# EAGLE board lisa_l (EAGLE 6.1), part 1 of 2
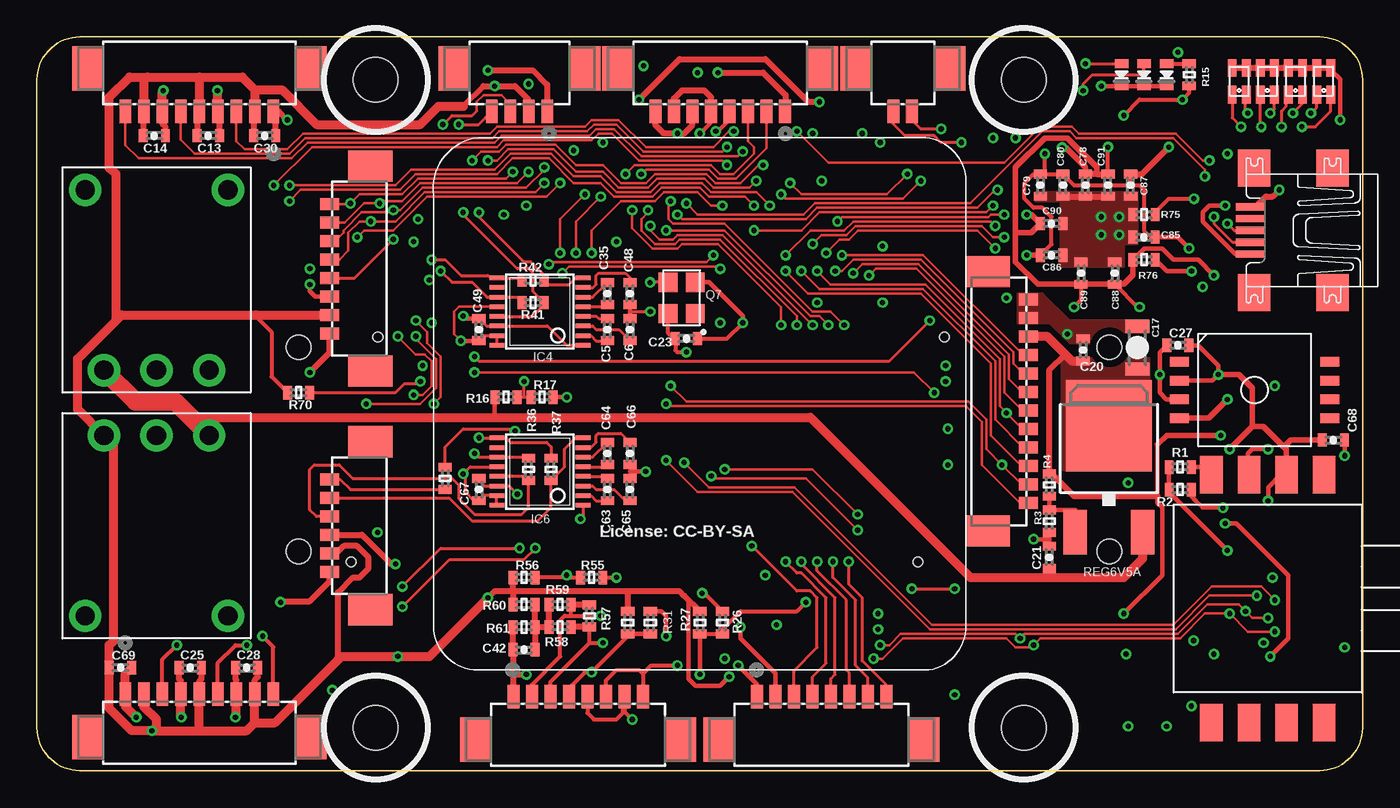
[diagram p6: board, top side]
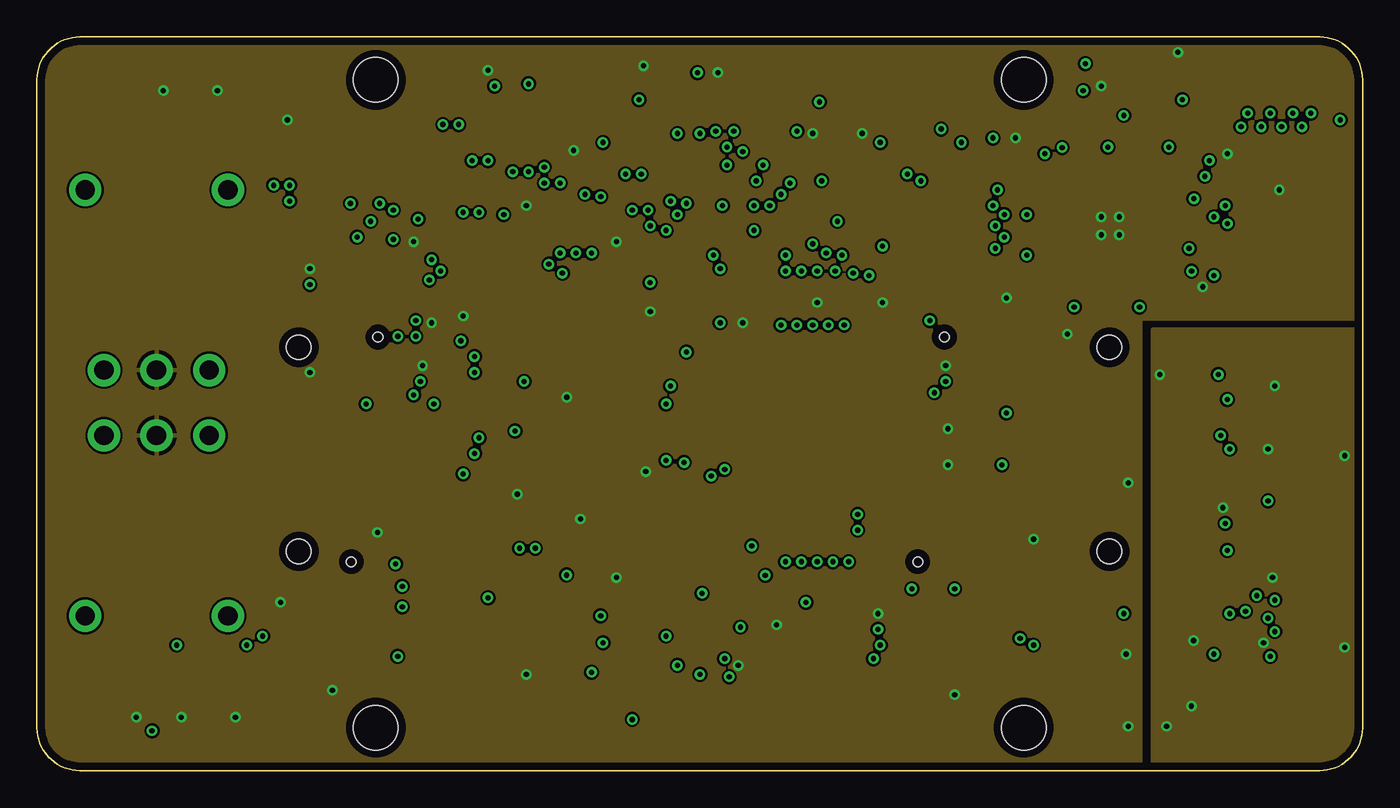
[diagram p7: board, inner layer Route2]
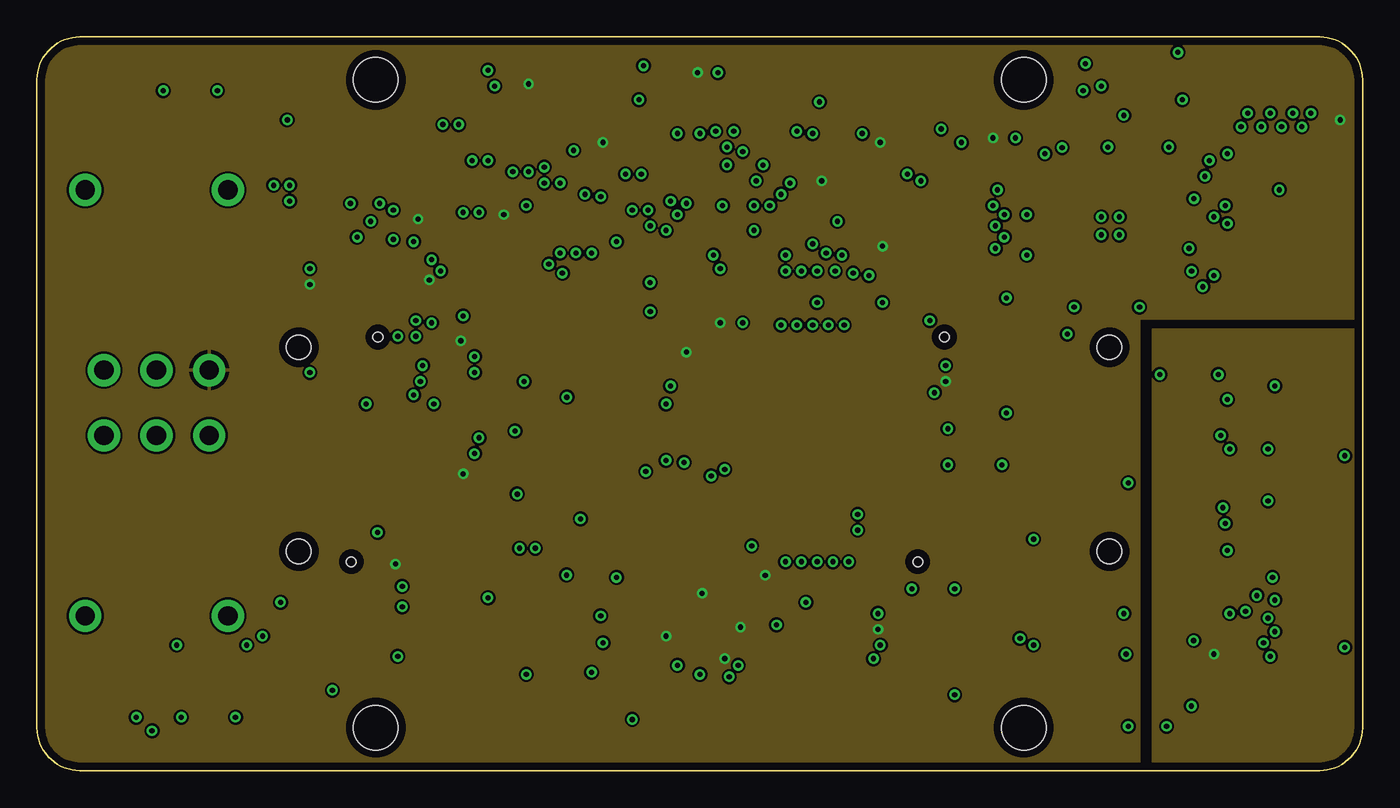
[diagram p8: board, inner layer Route15]
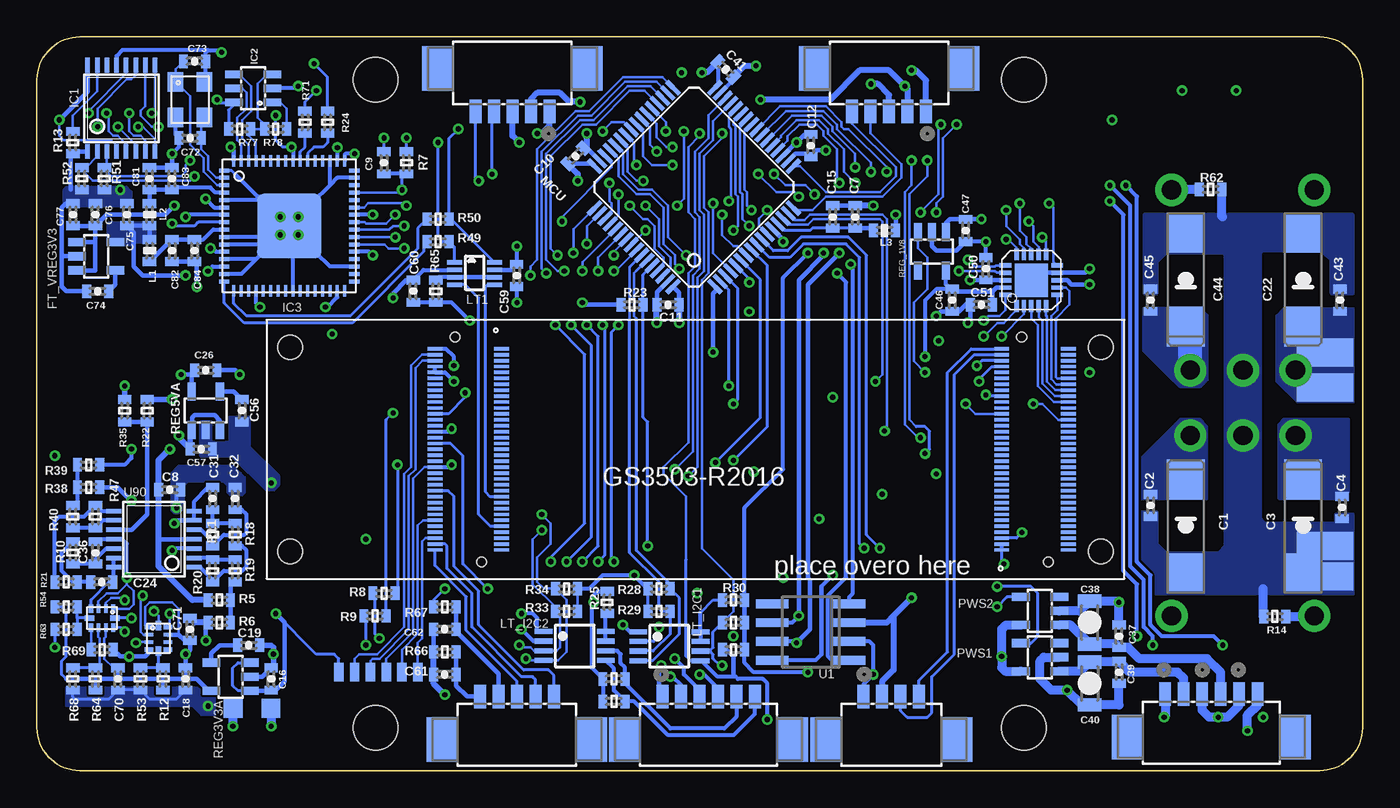
[diagram p9: board, bottom side, seen from below]

Size 89.6 x 49.6 mm. Coordinates in mm from the lower left corner, seen from the top.
Outline: 2.9,49.6 86.7,49.6 arc-90 89.6,46.7 89.6,2.9 arc-90 86.7,0 2.9,0 arc-90 0,2.9 0,46.7 arc-90 2.9,49.6
Copper layers (1*2+15*16): Top 0.035mm / dielectric 0.2mm / Route2 0.035mm / dielectric 1.5mm / Route15 0.035mm / dielectric 0.2mm / Bottom 0.035mm
Design rules: minimum track width 0.15mm, minimum drill 0.35mm, track to track 0.15mm, track to pad 0.15mm, pad to pad 0.15mm, via to via 0.15mm, smd to smd 0.15mm, copper to edge 20mil, drill to drill 8mil, minimum pad ring 0.177mm, minimum via ring 0.177mm, stop-mask expansion 4mil, vias tented up to drill 14mil, thermal gap 10mil
Net classes: 0 default: width 0.152 mm, drill 0.305 mm, clearance 0.152 mm; 1 supply: width 0.203 mm; 4 xxwide: width 0.203 mm; 5 USB: width 0.191 mm
Holes 3 mm at 66.7,46.7 66.7,2.9 22.9,46.7 22.9,2.9
bKeepout: area 19.9,43.7 to 25.9,49.7; area 63.7,43.7 to 69.7,49.7; area 19.9,-0.1 to 25.9,5.9; area 63.7,-0.1 to 69.7,5.9
tRestrict: area 63.6,43.6 to 69.8,49.8; area 63.6,-0.2 to 69.8,6; area 19.8,-0.2 to 26,6; area 19.8,43.6 to 26,49.8

## Footprints (pad centres in the part's own frame; a part is rotated, then mirrored left to right if it is on the bottom)
R-PQFP-N10 = smd 0.3 x 0.58: P$1 0.75,0.637; P$4 -0.75,0.637; P$6 -0.75,-0.637; P$9 0.75,-0.637 | smd 0.25 x 0.58: P$2 0.25,0.637; P$3 -0.25,0.637; P$7 -0.25,-0.637; P$8 0.25,-0.637 | smd 0.63 x 0.35: P$5 -0.863,0; P$10 0.863,0
CASE_1317 = smd 1.27 x 0.635: P$1 5.08,-1.905; P$2 5.08,-0.635; P$3 5.08,0.635; P$4 5.08,1.905; P$5 -5.08,1.905; P$6 -5.08,0.635; P$7 -5.08,-0.635; P$8 -5.08,-1.905
CASE1351 = smd 2.54 x 1.524: P$1 8.382,-3.81; P$2 8.382,-1.27; P$3 8.382,1.27; P$4 8.382,3.81; P$5 -8.382,3.81; P$6 -8.382,1.27; P$7 -8.382,-1.27; P$8 -8.382,-3.81
SOLD_PAD_150_75 = smd 3.81 x 1.905: P$1 0,0
7343/D = smd 2.7 x 2.55: + -3.175,0; - 3.175,0
0603-CAP = smd 0.6 x 0.9: P$1 -0.75,0; P$2 0.75,0
1206-CAP = smd 0.9 x 1.6: P$1 -1.45,0; P$2 1.45,0
PB-53261-06 = smd 0.8 x 1.6: 1 -3.125,1.1; 2 -1.875,1.1; 3 -0.625,1.1; 4 0.625,1.1; 5 1.875,1.1; 6 3.125,1.1 | smd 2.1 x 3: MNT1 -5.675,-1.8; MNT2 5.675,-1.8
PB-53398-12 = smd 0.8 x 1.3: 1 -6.875,1.25; 2 -5.625,1.25; 3 -4.375,1.25; 4 -3.125,1.25; 5 -1.875,1.25; 6 -0.625,1.25; 7 0.625,1.25; 8 1.875,1.25; 9 3.125,1.25; 10 4.375,1.25; 11 5.625,1.25; 12 6.875,1.25 | smd 2.1 x 3: PAD1 -8.775,-1.5; PAD2 8.775,-1.5
PB-53261-08 = smd 0.8 x 1.6: 1 -4.375,1.1; 2 -3.125,1.1; 3 -1.875,1.1; 4 -0.625,1.1; 5 0.625,1.1; 6 1.875,1.1; 7 3.125,1.1; 8 4.375,1.1 | smd 2.1 x 3: MNT1 -6.925,-1.8; MNT2 6.925,-1.8
PB-53398-08 = smd 0.8 x 1.3: 1 -4.375,1.25; 2 -3.125,1.25; 3 -1.875,1.25; 4 -0.625,1.25; 5 0.625,1.25; 6 1.875,1.25; 7 3.125,1.25; 8 4.375,1.25 | smd 2.1 x 3: PAD1 -6.925,-1.5; PAD2 6.925,-1.5
PB-53261-04 = smd 0.8 x 1.6: 1 -1.875,1.1; 2 -0.625,1.1; 3 0.625,1.1; 4 1.875,1.1 | smd 2.1 x 3: MNT1 -4.425,-1.8; MNT2 4.425,-1.8
PB-53261-02 = smd 0.8 x 1.6: 1 -0.625,1.1; 2 0.625,1.1 | smd 2.1 x 3: MNT1 -3.175,-1.8; MNT2 3.175,-1.8
PB-53261-05 = smd 0.8 x 1.6: 1 -2.5,1.1; 2 -1.25,1.1; 3 0,1.1; 4 1.25,1.1; 5 2.5,1.1 | smd 2.1 x 3: MNT1 -5.05,-1.8; MNT2 5.05,-1.8
PB-53261-09 = smd 0.8 x 1.6: 1 -5,1.1; 2 -3.75,1.1; 3 -2.5,1.1; 4 -1.25,1.1; 5 0,1.1; 6 1.25,1.1; 7 2.5,1.1; 8 3.75,1.1; 9 5,1.1 | smd 2.1 x 3: MNT1 -7.55,-1.8; MNT2 7.55,-1.8
PB-53398-06 = smd 0.8 x 1.3: 1 -3.125,1.25; 2 -1.875,1.25; 3 -0.625,1.25; 4 0.625,1.25; 5 1.875,1.25; 6 3.125,1.25 | smd 2.1 x 3: PAD1 -5.675,-1.5; PAD2 5.675,-1.5
UX60A-MB-5ST = smd 2 x 0.5: 1 2.25,1.6; 2 2.25,0.8; 3 2.25,0; 4 2.25,-0.8; 5 2.25,-1.6 | smd 2.2 x 2.5: M1 -3.3,-4.2; M2 -3.3,4.2; M3 2,4.2; M4 2,-4.2
SOT23-5 = smd 0.55 x 1.2: 1 -0.95,-1.3; 2 0,-1.3; 3 0.95,-1.3; 4 0.95,1.3; 5 -0.95,1.3
TSSOP16 = smd 0.305 x 0.991: 1 -2.275,-2.918; 2 -1.625,-2.918; 3 -0.975,-2.918; 4 -0.325,-2.918; 5 0.325,-2.918; 6 0.975,-2.918; 7 1.625,-2.918; 8 2.275,-2.918; 9 2.275,2.918; 10 1.625,2.918; 11 0.975,2.918; 12 0.325,2.918; 13 -0.325,2.918; 14 -0.975,2.918; 15 -1.625,2.918; 16 -2.275,2.918
SO23-6 = smd 0.5 x 1.2: 1 -0.95,-1.3; 2 0,-1.3; 3 0.95,-1.3; 4 0.95,1.3; 5 0,1.3; 6 -0.95,1.3
QFN64 = smd 0.75 x 0.25: P$1 -4.4,3.75; P$2 -4.4,3.25; P$3 -4.4,2.75; P$4 -4.4,2.25; P$5 -4.4,1.75; P$6 -4.4,1.25; P$7 -4.4,0.75; P$8 -4.4,0.25; P$9 -4.4,-0.25; P$10 -4.4,-0.75; P$11 -4.4,-1.25; P$12 -4.4,-1.75; P$13 -4.4,-2.25; P$14 -4.4,-2.75; P$15 -4.4,-3.25; P$16 -4.4,-3.75; P$33 4.4,-3.75; P$34 4.4,-3.25; P$35 4.4,-2.75; P$36 4.4,-2.25; P$37 4.4,-1.75; P$38 4.4,-1.25; P$39 4.4,-0.75; P$40 4.4,-0.25; P$41 4.4,0.25; P$42 4.4,0.75; P$43 4.4,1.25; P$44 4.4,1.75; P$45 4.4,2.25; P$46 4.4,2.75; P$47 4.4,3.25; P$48 4.4,3.75 | smd 0.25 x 0.75: P$17 -3.75,-4.4; P$18 -3.25,-4.4; P$19 -2.75,-4.4; P$20 -2.25,-4.4; P$21 -1.75,-4.4; P$22 -1.25,-4.4; P$23 -0.75,-4.4; P$24 -0.25,-4.4; P$25 0.25,-4.4; P$26 0.75,-4.4; P$27 1.25,-4.4; P$28 1.75,-4.4; P$29 2.25,-4.4; P$30 2.75,-4.4; P$31 3.25,-4.4; P$32 3.75,-4.4; P$49 3.75,4.4; P$50 3.25,4.4; P$51 2.75,4.4; P$52 2.25,4.4; P$53 1.75,4.4; P$54 1.25,4.4; P$55 0.75,4.4; P$56 0.25,4.4; P$57 -0.25,4.4; P$58 -0.75,4.4; P$59 -1.25,4.4; P$60 -1.75,4.4; P$61 -2.25,4.4; P$62 -2.75,4.4; P$63 -3.25,4.4; P$64 -3.75,4.4 | smd 4.35 x 4.35: P$65 0,0
OVERO = smd 1 x 0.23: ADCIN2 17.6,-2; ADCIN3 17.6,2; ADCIN4 17.6,5.2; ADCIN5 17.6,0.8; ADCIN6 17.6,0; ADCIN7 17.6,-4.4; AGND 17.6,1.2; AUXLF 17.6,6; AUXRF 17.6,4.8; EM_A1 -25.2,2; EM_A2 -20.7,2.8; EM_A3 -25.2,2.4; EM_A4 -25.2,3.2; EM_A5 -20.7,2; EM_A6 -25.2,1.6; EM_A7 -20.7,1.6; EM_A8 -20.7,2.4; EM_A9 -25.2,3.6; EM_A10 -25.2,2.8; EM_CLK -25.2,6.8; EM_D0 -25.2,1.2; EM_D1 -25.2,0; EM_D2 -20.7,1.2; EM_D3 -20.7,0.4; EM_D4 -20.7,-0.4; EM_D5 -20.7,-1.2; EM_D6 -25.2,-0.8; EM_D7 -25.2,-1.6; EM_D8 -25.2,0.4; EM_D9 -25.2,0.8; EM_D10 -20.7,0.8; EM_D11 -20.7,0; EM_D12 -20.7,-0.8; EM_D13 -25.2,-0.4; EM_D14 -25.2,-1.2; EM_D15 -20.7,-1.6; EM_NADV_ALE -20.7,4.4; EM_NBE0 -25.2,4.8; EM_NBE1 -25.2,6.4; EM_NCS0 -25.2,5.2; EM_NCS1 -25.2,4.4; EM_NCS4 -20.7,5.2; EM_NCS5_ETH0 -20.7,5.6; EM_NCS6 -25.2,5.6; EM_NOE -20.7,4; EM_NWE -20.7,4.8; EM_NWP -25.2,4; EM_WAIT0 -25.2,6; GND -20.7,6; GND@33 -20.7,-6; GND@56 17.6,-1.2; GND@70 17.6,-6.8; GPIO0_WAKEUP 13.1,-3.6; GPIO12_MMC3_CLK -25.2,-5.2; GPIO13_MMC3_CMD -20.7,-2; GPIO14_MMC3_DAT4 -20.7,-4.4; GPIO17_MMC3_D3 -20.7,-5.2; GPIO18_MMC3_D0 -20.7,-3.2; GPIO19_MMC3_D1 -25.2,-6.8; GPIO20_MMC3_D2 -25.2,-5.6; GPIO21_MMC3_DAT7 -20.7,-4.8; GPIO22_MMC3_DAT6 -25.2,-6.4; GPIO23_MMC3_DAT5 -25.2,-6; GPIO64_ETH0_NRESET -20.7,3.2; GPIO65_ETH1_IRQ1 -20.7,3.6; GPIO66_L_PCLK 13.1,5.6; GPIO67_L_LCLK 13.1,6.8; GPIO68_L_FCLK 13.1,6.4; GPIO69_L_BIAS 17.6,4; GPIO70_L_DD00 13.1,-6; GPIO71_L_DD01 13.1,-6.4; GPIO72_L_DD02 13.1,-4.8; GPIO73_L_DD03 13.1,-5.6; GPIO74_L_DD04 13.1,-4.4; GPIO75_L_DD05 13.1,-5.2; GPIO76_L_DD06 13.1,6; GPIO77_L_DD07 13.1,4.4; GPIO78_L_DD08 13.1,4.8; GPIO79_L_DD09 13.1,4; GPIO80_L_DD10 13.1,-2.8; GPIO81_L_DD11 13.1,-2.4; GPIO82_L_DD12 17.6,-2.8; GPIO83_L_DD13 13.1,-0.4; GPIO84_L_DD14 13.1,0.4; GPIO85_L_DD15 13.1,0.8; GPIO86_L_DD16 17.6,3.6; GPIO87_L_DD17 13.1,2.4; GPIO88_L_DD18 13.1,2.8; GPIO89_L_DD19 13.1,3.6; GPIO90_L_DD20 17.6,3.2; GPIO91_L_DD21 13.1,2; GPIO92_L_DD22 13.1,-1.2; GPIO93_L_DD23 17.6,-3.2; GPIO114_SPI1_NIRQ -25.2,-4.8; GPIO127_TS_IRQ 13.1,-4; GPIO128_GPS_PPS 13.1,-1.6; GPIO144_GPT9_PWM 13.1,0; GPIO145_GPT10_PWM 17.6,-0.8; GPIO146_GPT11_PWM 13.1,1.2; GPIO147_GPT8_PWM 13.1,-0.8; GPIO148_TXD1 -20.7,-2.4; GPIO149_MMC3_CD -25.2,-2.8; GPIO150_MMC3_WP -25.2,-2.4; GPIO151_RXD1 -25.2,-2; GPIO163_IR_CTS3 13.1,1.6; GPIO165_IR_RXD3 13.1,5.2; GPIO166_IR_TXD3 13.1,3.2; GPIO168_USBH_CPEN -20.7,-4; GPIO170_HDQ_1WIRE 17.6,2.4; GPIO171_SPI1_CLK -25.2,-4; GPIO172_SPI1_MOSI -25.2,-3.6; GPIO173_SPI1_MISO -25.2,-3.2; GPIO174_SPI1_CS0 -20.7,-3.6; GPIO175_SPI1_CS1 -25.2,-4.4; GPIO176_ETH0_IRQ -20.7,-2.8; GPIO184_I2C3_SCL 13.1,-2; GPIO185_I2C3_SDA 13.1,-3.2; HSOLF 17.6,-6; HSORF 17.6,-6.4; MIC_MAIN_MF 17.6,-1.6; MIC_SUB_MF 17.6,5.6; N_MANUAL_RESET 13.1,-6.8; NC@62 17.6,-3.6; NC@63 17.6,-4; POWERON 17.6,-4.8; PWM0 17.6,4.4; PWM1 17.6,1.6; SYSEN 17.6,-2.4; USBH_DM -20.7,-6.8; USBH_DP -20.7,-6.4; USBH_VBUS -20.7,-5.6; USBOTG_DM 17.6,6.4; USBOTG_DP 17.6,6.8; USBOTG_ID 17.6,2.8; USBOTG_VBUS 17.6,-0.4; VBACKUP 17.6,0.4; VSYSTEM@1 -20.7,6.8; VSYSTEM@2 -20.7,6.4; VSYSTEM@66 17.6,-5.2; VSYSTEM@67 17.6,-5.6 | hole 1.65: 27.4,6.9; 27.4,-6.9; -27.4,6.9; -27.4,-6.9 | hole 0.65: -23.85,7.6; -22.05,-7.6; 14.45,7.6; 16.25,-7.6
0603-IND = smd 0.6 x 0.9: P$1 -0.75,0; P$2 0.75,0
DUO_LED = smd 1.2 x 0.6: 1 0.9,0.475; 2 -0.9,0.475; 3 -0.9,-0.475; 4 0.9,-0.475
0603-LED = smd 0.6 x 0.9: A 0.75,0; C -0.75,0
US8 = smd 0.3 x 1: 1 -0.75,-1.35; 2 -0.25,-1.35; 3 0.25,-1.35; 4 0.75,-1.35; 5 0.75,1.35; 6 0.25,1.35; 7 -0.25,1.35; 8 -0.75,1.35
LFCSP-20 = smd 0.8 x 0.3: P$1 -1.75,1; P$2 -1.75,0.5; P$3 -1.75,0; P$4 -1.75,-0.5; P$5 -1.75,-1; P$11 1.75,-1; P$12 1.75,-0.5; P$13 1.75,0; P$14 1.75,0.5; P$15 1.75,1 | smd 0.3 x 0.8: P$6 -1,-1.75; P$7 -0.5,-1.75; P$8 0,-1.75; P$9 0.5,-1.75; P$10 1,-1.75; P$16 1,1.75; P$17 0.5,1.75; P$18 0,1.75; P$19 -0.5,1.75; P$20 -1,1.75 | smd 2.25 x 2.25: P$21 0,0
TSSOP_B3 = smd 1.2 x 0.35: 1 -2.925,0.975; 2 -2.925,0.325; 3 -2.925,-0.325; 4 -2.925,-0.975; 5 1.275,-0.975; 6 1.275,-0.325; 7 1.275,0.325; 8 1.275,0.975
LQFP64 = smd 1.2 x 0.3: 1 -5.75,3.75; 2 -5.75,3.25; 3 -5.75,2.75; 4 -5.75,2.25; 5 -5.75,1.75; 6 -5.75,1.25; 7 -5.75,0.75; 8 -5.75,0.25; 9 -5.75,-0.25; 10 -5.75,-0.75; 11 -5.75,-1.25; 12 -5.75,-1.75; 13 -5.75,-2.25; 14 -5.75,-2.75; 15 -5.75,-3.25; 16 -5.75,-3.75; 33 5.75,-3.75; 34 5.75,-3.25; 35 5.75,-2.75; 36 5.75,-2.25; 37 5.75,-1.75; 38 5.75,-1.25; 39 5.75,-0.75; 40 5.75,-0.25; 41 5.75,0.25; 42 5.75,0.75; 43 5.75,1.25; 44 5.75,1.75; 45 5.75,2.25; 46 5.75,2.75; 47 5.75,3.25; 48 5.75,3.75 | smd 0.3 x 1.2: 17 -3.75,-5.75; 18 -3.25,-5.75; 19 -2.75,-5.75; 20 -2.25,-5.75; 21 -1.75,-5.75; 22 -1.25,-5.75; 23 -0.75,-5.75; 24 -0.25,-5.75; 25 0.25,-5.75; 26 0.75,-5.75; 27 1.25,-5.75; 28 1.75,-5.75; 29 2.25,-5.75; 30 2.75,-5.75; 31 3.25,-5.75; 32 3.75,-5.75; 49 3.75,5.75; 50 3.25,5.75; 51 2.75,5.75; 52 2.25,5.75; 53 1.75,5.75; 54 1.25,5.75; 55 0.75,5.75; 56 0.25,5.75; 57 -0.25,5.75; 58 -0.75,5.75; 59 -1.25,5.75; 60 -1.75,5.75; 61 -2.25,5.75; 62 -2.75,5.75; 63 -3.25,5.75; 64 -3.75,5.75
SOT23-5L = smd 0.55 x 1.2: 1 -0.95,-1.3; 2 0,-1.3; 3 0.95,-1.3; 4 0.95,1.3; 5 -0.95,1.3
ABM8 = smd 1.3 x 1.05: P$1 -1.2,-0.975; P$2 1.2,-0.975; P$3 1.2,0.975; P$4 -1.2,0.975
ASE_OSCILLATOR = smd 1.295 x 1.27: 1 -1.041,-0.902; 2 1.067,-0.902; 3 1.067,0.927; 4 -1.041,0.927
0603-RES = smd 0.6 x 0.9: P$1 -0.75,0; P$2 0.75,0
DPACK = smd 1.6 x 3: 1 -2.28,-4.8; 3 2.28,-4.8 | smd 5.8 x 6.2: 4 0,2.38
SOT-23-5 = smd 0.55 x 1.2: 1 -0.95,-1.3; 2 0,-1.3; 3 0.95,-1.3; 4 0.95,1.3; 5 -0.95,1.3
PTH_TH = drill 1.3 pad 2.184: P$1 -6.096,3.556; P$2 -6.096,0; P$3 -6.096,-3.556; P$4 6.096,-4.826; P$5 6.096,4.826
SO-08 = smd 0.6 x 2.2: 1 -1.905,-2.6; 2 -0.635,-2.6; 3 0.635,-2.6; 4 1.905,-2.6; 5 1.905,2.6; 6 0.635,2.6; 7 -0.635,2.6; 8 -1.905,2.6
TSSOP14 = smd 0.305 x 0.991: 1 -1.905,-2.718; 2 -1.27,-2.718; 3 -0.635,-2.718; 4 0,-2.718; 5 0.635,-2.718; 6 1.27,-2.718; 7 1.905,-2.718; 8 1.905,2.718; 9 1.27,2.718; 10 0.635,2.718; 11 0,2.718; 12 -0.635,2.718; 13 -1.27,2.718; 14 -1.905,2.718
SOLDER_PAD_SMALL = smd 1.27 x 0.635: P$1 0,0
GND-GNDA = smd 1.27 x 1.27: GND -1.27,0; GNDA 1.27,0

## Placement (x,y rotation side)
ADC1  ADS1114  [R-PQFP-N10]  81.39,8.94 90 bottom
ADC2  ADS1114  [R-PQFP-N10]  85.2,10.31 0 bottom
BARO_ABS  MPX6115  [CASE_1317]  82.3,25.73 180 top
BARO_DIF  MPXV5004DP  [CASE1351]  83.19,11.63 90 top
BAT_IN  SOLDER_PAD150_75  [SOLD_PAD_150_75]  2.52,28.27 0 bottom
BAT_IN1  SOLDER_PAD150_75  [SOLD_PAD_150_75]  2.52,25.91 0 bottom
C1  100uF/20V  [7343/D]  11.95,16.51 270 bottom
C2  100nF  [0603-CAP]  14.33,17.93 270 bottom
C3  220uF/10V  [7343/D]  4.02,16.51 270 bottom
C4  100nF  [0603-CAP]  1.38,17.78 270 bottom
C5  100nF  [0603-CAP]  38.56,29.82 90 top
C6  100nF  [0603-CAP]  40.09,29.82 270 top
C7  10nF  [0603-CAP]  34.29,37.44 270 bottom
C8  100nF  [0603-CAP]  80.62,19 0 bottom
C9  100nF  [0603-CAP]  66.15,41.09 270 bottom
C10  100nF  [0603-CAP]  53.19,41.55 225 bottom
C11  100nF  [0603-CAP]  46.94,31.49 0 bottom
C12  100nF  [0603-CAP]  37.29,42.26 90 bottom
C13  100nF  [0603-CAP]  11.59,42.92 180 top
C14  100nF  [0603-CAP]  7.93,42.92 180 top
C15  1uF  [0603-CAP]  35.82,37.44 270 bottom
C16  2.2uF/Low ESR  [0603-CAP]  73.77,6.19 90 bottom
C17  22uF/10V  [1206-CAP]  74.38,28.6 90 top
C18  4.7uF/10V/Low ESR  [0603-CAP]  79.56,6.19 270 bottom
C19  10nF/16V  [0603-CAP]  75.29,8.48 0 bottom
C20  100nF  [0603-CAP]  70.72,28.44 90 top
C21  100nF  [0603-CAP]  68.43,14.42 90 top
C22  100uF/20V  [7343/D]  4.02,33.2 90 bottom
C23  10nF  [0603-CAP]  43.9,29.21 180 top
C24  330nF  [0603-CAP]  85.22,12.75 180 bottom
C25  100nF  [0603-CAP]  10.37,6.96 0 top
C26  4.7uF/10V/Low ESR  [0603-CAP]  78.19,27.07 0 bottom
C27  100nF  [0603-CAP]  77.12,28.75 180 top
C28  100nF  [0603-CAP]  14.18,6.96 0 top
C30  100nF  [0603-CAP]  15.4,42.92 180 top
C31  330nF  [0603-CAP]  77.73,18.39 270 bottom
C32  170nF  [0603-CAP]  76.2,18.39 270 bottom
C35  100nF  [0603-CAP]  38.56,32.25 90 top
C36  170nF  [0603-CAP]  85.65,14.73 270 bottom
C37  100nF  [0603-CAP]  16.46,9.09 90 bottom
C38  33uF/6V  [1206-CAP]  18.44,10 90 bottom
C39  100nF  [0603-CAP]  16.46,6.65 270 bottom
C40  33uF/6V  [1206-CAP]  18.44,5.89 270 bottom
C41  100nF  [0603-CAP]  43.04,47.41 135 bottom
C42  4.7nF  [0603-CAP]  32.92,8.18 0 top
C43  100nF  [0603-CAP]  1.53,31.8 90 bottom
C44  220uF/10V  [7343/D]  11.95,33.2 90 bottom
C45  100nF  [0603-CAP]  14.33,31.8 90 bottom
C46  10uF  [0603-CAP]  27.74,31.8 270 bottom
C47  10uF  [0603-CAP]  26.83,36.52 270 bottom
C48  100nF  [0603-CAP]  40.09,32.25 90 top
C49  100nF  [0603-CAP]  29.87,29.82 90 top
C50  100nF  [0603-CAP]  25.46,33.93 90 bottom
C51  100nF  [0603-CAP]  25.76,31.49 180 bottom
C56  10nF/16V  [0603-CAP]  75.75,24.33 270 bottom
C57  2.2uF/Low ESR  [0603-CAP]  78.49,21.74 0 bottom
C59  100nF  [0603-CAP]  57.18,33.47 270 bottom
C60  100nF  [0603-CAP]  64.16,32.41 90 bottom
C61  10nF  [0603-CAP]  62.03,6.5 180 bottom
C62  4.7uF  [0603-CAP]  62.03,9.55 180 bottom
C63  100nF  [0603-CAP]  38.56,19 90 top
C64  100nF  [0603-CAP]  38.56,21.43 90 top
C65  100nF  [0603-CAP]  40.09,19 90 top
C66  100nF  [0603-CAP]  40.09,21.43 270 top
C67  100nF  [0603-CAP]  29.87,19 270 top
C68  100nF  [0603-CAP]  87.63,22.35 0 top
C69  100nF  [0603-CAP]  5.64,6.96 180 top
C70  100nF  [0603-CAP]  84.13,6.19 270 bottom
C71  100nF  [0603-CAP]  79.25,9.55 90 bottom
C72  30pF  [0603-CAP]  79.25,42.77 0 bottom
C73  30pF  [0603-CAP]  78.95,47.95 180 bottom
C74  470pF  [0603-CAP]  85.5,32.41 0 bottom
C75  4.7uF/low ESR  [0603-CAP]  83.52,37.59 90 bottom
C76  2.2uF/low ESR  [0603-CAP]  85.65,37.59 90 bottom
C77  100nF  [0603-CAP]  87.18,37.59 270 bottom
C78  100nF  [0603-CAP]  70.87,39.57 90 top
C79  3.3uF  [0603-CAP]  67.82,39.57 270 top
C80  100nF  [0603-CAP]  69.35,39.57 90 top
C81  3.3uF  [0603-CAP]  82,40.03 90 bottom
C82  3.3uF  [0603-CAP]  80.47,35.15 270 bottom
C83  100nF  [0603-CAP]  80.47,40.03 90 bottom
C84  100nF  [0603-CAP]  78.95,35.15 270 bottom
C85  100nF  [0603-CAP]  74.83,36.06 0 top
C86  100nF  [0603-CAP]  68.58,34.85 180 top
C87  100nF  [0603-CAP]  73.92,39.57 90 top
C88  100nF  [0603-CAP]  72.85,33.63 270 top
C89  100nF  [0603-CAP]  70.57,33.63 270 top
C90  100nF  [0603-CAP]  68.58,36.98 180 top
C91  100nF  [0603-CAP]  72.39,39.57 90 top
CON_I2C2  0  [PB-53261-06]  44.2,3.91 0 bottom
CON_IMU  0  [PB-53398-12]  65.77,24.96 270 top
CON_LIGHTS  0  [PB-53261-06]  10.22,4.06 0 bottom
CON_MC1  0  [PB-53261-08]  46.18,45.67 180 top
CON_MC2  0  [PB-53261-08]  36.58,3.91 0 top
CON_OV_SPI  0  [PB-53398-08]  21.04,33.93 90 top
CON_OV_UART1  0  [PB-53261-04]  32.62,45.67 180 top
CON_OV_UART3  0  [PB-53261-02]  58.53,45.67 180 top
CON_OV_USB_OTG  0  [PB-53261-05]  57.15,3.91 0 bottom
CON_OV_USBH  0  [PB-53261-04]  31.86,3.91 0 bottom
CON_SERVOS_1  0  [PB-53261-09]  10.98,45.67 180 top
CON_SERVOS_2  0  [PB-53261-09]  10.98,4.06 0 top
CON_SPARE  0  [PB-53261-08]  53.04,3.91 0 top
CON_USART1  0  [PB-53398-06]  21.04,16.56 90 top
CON_USART2  0  [PB-53261-05]  32.01,45.67 180 bottom
CON_USART3  0  [PB-53261-05]  57.46,45.67 180 bottom
CON_USB1  MINI-USB-UX60A-MB-5ST  [UX60A-MB-5ST]  84.28,36.52 180 top
FT_VREG3V3  MIC5219  [SOT23-5]  85.6,34.77 270 bottom
GND_IN  SOLDER_PAD150_75  [SOLD_PAD_150_75]  2.52,15.19 0 bottom
GND_IN1  SOLDER_PAD150_75  [SOLD_PAD_150_75]  2.52,13.13 180 bottom
IC1  STP08CP05  [TSSOP16]  83.9,44.78 0 bottom
IC2  93C46-SO23-6  [SO23-6]  74.99,46.12 90 bottom
IC3  FT2232HQ  [QFN64]  72.55,36.83 0 bottom
IC4  MAX3221EUE  [TSSOP16]  33.99,31.04 90 top
IC6  MAX3221CUE  [TSSOP16]  33.99,20.22 90 top
J3&4  OVERO  [OVERO]  45.09,21.72 180 bottom
L1  [0603-IND]  82,35.15 270 bottom
L2  [0603-IND]  82,37.59 90 bottom
L3  [0603-IND]  32.31,36.52 180 bottom
LED_1  LED_DUO  [DUO_LED]  85.07,46.61 90 top
LED_2  LED_DUO  [DUO_LED]  83.16,46.61 90 top
LED_3  LED_DUO  [DUO_LED]  81.26,46.61 90 top
LED_4  LED_DUO  [DUO_LED]  86.97,46.61 90 top
LED_FT  [0603-LED]  76.36,47.04 90 top
LED_JRXD  [0603-LED]  74.83,47.04 90 top
LED_JTXD  [0603-LED]  73.31,47.04 90 top
LT1  TXS0102DCU  [US8]  60.02,33.6 270 bottom
LT_3  AD3308BCPZ  [LFCSP-20]  22.39,33.16 90 bottom
LT_I2C1  PCA9306DP  [TSSOP_B3]  46.03,8.4 0 bottom
LT_I2C2  PCA9306DP  [TSSOP_B3]  52.43,8.43 0 bottom
MCU  STM32-M-64  [LQFP64]  45.19,39.45 135 bottom
PWS1  TPS2051B  [SOT23-5L]  21.8,7.67 90 bottom
PWS2  TPS2051B  [SOT23-5L]  21.8,10.79 90 bottom
Q3  12Mhz  [ABM8]  79.25,45.36 270 bottom
Q7  8MHz  [ASE_OSCILLATOR]  43.59,31.95 90 top
R1  100k  [0603-RES]  77.27,20.52 180 top
R2  130k  [0603-RES]  77.27,19 0 top
R3  3.9k  [0603-RES]  68.43,16.86 90 top
R4  1k  [0603-RES]  68.43,19.3 90 top
R5  6.1k  [0603-RES]  77.27,11.53 0 bottom
R6  1k  [0603-RES]  77.27,10 180 bottom
R7  10k  [0603-RES]  64.62,41.09 90 bottom
R8  0/DNP  [0603-RES]  66.15,11.99 0 bottom
R9  0/DNP  [0603-RES]  66.76,10.46 0 bottom
R10  10k  [0603-RES]  87.18,14.73 270 bottom
R11  10k  [0603-RES]  77.73,15.95 270 bottom
R12  10k  [0603-RES]  81.08,6.19 90 bottom
R13  2k  [0603-RES]  87.18,42.47 90 bottom
R14  353R  [0603-RES]  5.93,10.41 0 bottom
R15  470R  [0603-RES]  77.88,47.04 270 top
R16  100k  [0603-RES]  31.7,25.24 180 top
R17  16k  [0603-RES]  34.14,25.24 180 top
R18  10k  [0603-RES]  76.2,15.95 270 bottom
R19  100k  [0603-RES]  76.2,13.51 270 bottom
R20  130k  [0603-RES]  77.73,13.51 90 bottom
R21  10k  [0603-RES]  87.63,12.75 180 bottom
R22  100k  [0603-RES]  82.15,24.33 90 bottom
R23  10k  [0603-RES]  49.38,31.49 0 bottom
R24  470R  [0603-RES]  69.96,43.84 270 bottom
R25  200k  [0603-RES]  51.06,11.38 90 bottom
R26  0/DNP  [0603-RES]  46.33,10 270 top
R27  0/DNP  [0603-RES]  44.81,10 270 top
R28  4.7k  [0603-RES]  47.55,12.29 0 bottom
R29  4.7k  [0603-RES]  47.55,10.77 0 bottom
R30  200k  [0603-RES]  42.52,11.53 180 bottom
R31  0/DNP  [0603-RES]  41.46,10 270 top
R32  0/DNP  [0603-RES]  39.93,10 270 top
R33  4.7k  [0603-RES]  53.8,10.77 0 bottom
R34  4.7k  [0603-RES]  53.8,12.29 0 bottom
R35  136k  [0603-RES]  83.67,24.33 270 bottom
R36  0R/DNP  [0603-RES]  33.23,20.37 90 top
R37  0R/DNP  [0603-RES]  34.75,20.37 90 top
R38  1.5k  [0603-RES]  86.11,19.15 180 bottom
R39  1k  [0603-RES]  86.11,20.67 0 bottom
R40  100k  [0603-RES]  87.18,17.17 90 bottom
R41  DNP/0  [0603-RES]  33.53,31.65 0 top
R42  DNP/0  [0603-RES]  33.53,33.17 0 top
R43  4.7k  [0603-RES]  50.6,4.67 180 bottom
R44  4.7k  [0603-RES]  50.6,6.19 180 bottom
R45  4.7k  [0603-RES]  42.52,10 180 bottom
R46  4.7k  [0603-RES]  42.52,8.18 180 bottom
R47  136k  [0603-RES]  85.65,17.17 270 bottom
R48  0/DNP  [0603-RES]  27.59,19.76 270 top
R49  0R  [0603-RES]  62.49,35.76 0 bottom
R50  0R  [0603-RES]  62.49,37.28 0 bottom
R51  2k  [0603-RES]  85.04,40.03 90 bottom
R52  2k  [0603-RES]  86.57,40.03 90 bottom
R53  10k  [0603-RES]  82.61,6.19 90 bottom
R54  10k  [0603-RES]  87.63,11.07 0 bottom
R55  10k  [0603-RES]  37.49,13.05 180 top
R56  0R/DNP  [0603-RES]  32.92,13.05 180 top
R57  120R/DNP  [0603-RES]  37.34,10.46 90 top
R58  60R/DNP  [0603-RES]  35.36,9.7 180 top
R59  60R/DNP  [0603-RES]  35.36,11.22 0 top
R60  4.7k/DNP  [0603-RES]  32.92,11.22 0 top
R61  4.7k/DNP  [0603-RES]  32.92,9.7 180 top
R62  1k89  [0603-RES]  10.27,39.29 180 bottom
R63  10k  [0603-RES]  87.63,9.55 0 bottom
R64  10k  [0603-RES]  85.65,6.19 270 bottom
R65  100R  [0603-RES]  62.64,32.41 270 bottom
R66  120R  [0603-RES]  62.03,8.02 0 bottom
R67  120R  [0603-RES]  62.03,11.07 0 bottom
R68  10k  [0603-RES]  87.18,6.19 90 bottom
R69  0R  [0603-RES]  85.2,8.18 180 bottom
R70  0R/DNP  [0603-RES]  17.68,25.55 0 top
R71  470R  [0603-RES]  71.48,43.84 270 bottom
R75  12k  [0603-RES]  74.83,37.59 0 top
R76  12k  [0603-RES]  74.83,34.54 0 top
R77  10k  [0603-RES]  75.9,43.38 180 bottom
R78  2k  [0603-RES]  73.46,43.38 0 bottom
REG3V3A  LP2992  [SOT23-5]  76.51,6.35 90 bottom
REG5VA  LP2992  [SOT23-5]  78.19,24.33 0 bottom
REG6V5A  LM317MBDT  [DPACK]  72.46,20.93 0 top
REG_1V8  MIC5247-1.8V  [SOT-23-5]  29.11,35.1 180 bottom
REG_3V3D  PTHTH  [PTH_TH]  8.08,33.17 90 top
REG_5VD  PTHTH  [PTH_TH]  8.08,16.56 270 top
U1  MCP2551SN  [SO-08]  37.29,9.37 90 bottom
U90  AD8554ARU  [TSSOP14]  81.69,15.64 90 bottom
U$1  SOLDER_PAD  [SOLDER_PAD_SMALL]  69.19,6.65 90 bottom
U$2  SOLDER_PAD  [SOLDER_PAD_SMALL]  68.13,6.65 90 bottom
U$3  SOLDER_PAD  [SOLDER_PAD_SMALL]  67.06,6.65 270 bottom
U$4  SOLDER_PAD  [SOLDER_PAD_SMALL]  65.99,6.65 90 bottom
U$5  SOLDER_PAD  [SOLDER_PAD_SMALL]  64.93,6.65 270 bottom
U$6  SOLDER_PAD  [SOLDER_PAD_SMALL]  63.86,6.65 270 bottom
~NUDEV~1  GND-GNDA  [GND-GNDA]  75.06,4.21 180 bottom